# EAGLE schematic schematic (EAGLE 9.2.2)

## Sheet 1 of 3
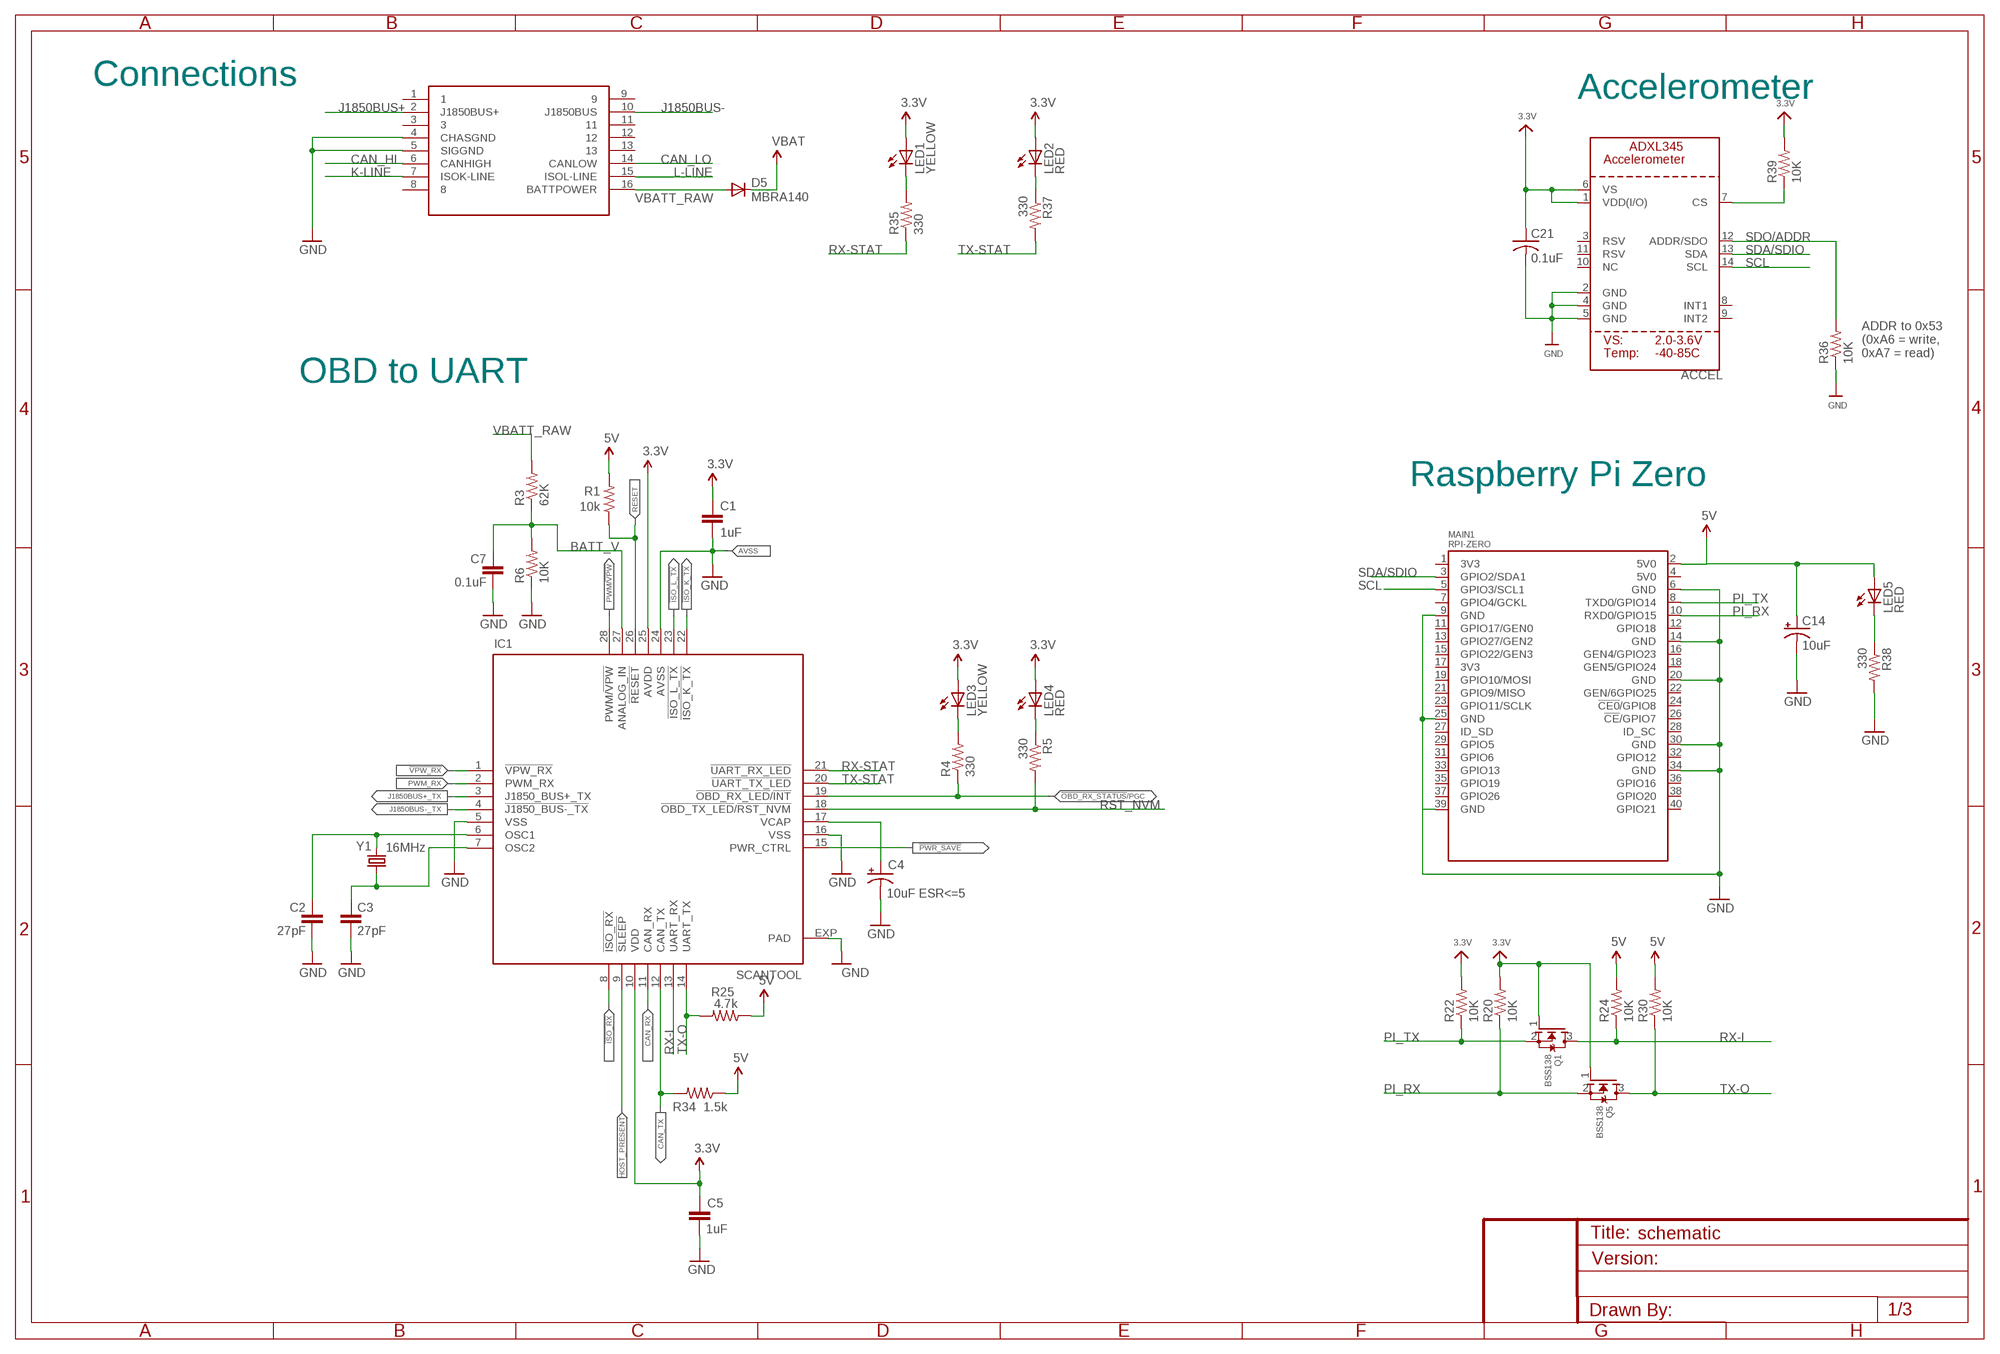
[diagram p0: schematic, sheet 1]

### Parts
ACCEL  ACCEL_ADXL345  [LGA14]
C1  1uF  CAP0402-CAP  [0402-CAP]
C2  27pF  CAP0402-CAP  [0402-CAP]
C3  27pF  CAP0402-CAP  [0402-CAP]
C4  10uF ESR<=5  CAP_POL1206  [EIA3216]
C5  1uF  CAP0402-CAP  [0402-CAP]
C7  0.1uF  CAP0402-CAP  [0402-CAP]
C14  10uF  CAP_POL1206  [EIA3216]
C21  0.1uF  C-USC0805  [C0805]
D5  MBRA140  DIODESMA  [SMA-DIODE]
IC1  SCANTOOL  [_STN_SCANTOOL_QFN-28-S]
LED1  YELLOW  LED0603  [LED-0603]
LED2  RED  LED0603  [LED-0603]
LED3  YELLOW  LED0603  [LED-0603]
LED4  RED  LED0603  [LED-0603]
LED5  RED  LED0603  [LED-0603]
MAIN1  RPI-ZERO  [RASPBERRYPI_BASTELSTUBE_V13_RASPI_BOARD_B+_FULL]
OBD_CONN  OBDII  [OBDII]
Q1  BSS138  MOSFET-NWIDE  [SOT23-WIDE]
Q5  BSS138  MOSFET-NWIDE  [SOT23-WIDE]
R1  10k  RESISTOR0402-RES  [0402-RES]
R3  62K  RESISTOR0402-RES  [0402-RES]
R4  330  RESISTOR0402-RES  [0402-RES]
R5  330  RESISTOR0402-RES  [0402-RES]
R6  10K  RESISTOR0402-RES  [0402-RES]
R20  10K  R-US_R0805  [R0805]
R22  10K  R-US_R0805  [R0805]
R24  10K  R-US_R0805  [R0805]
R25  4.7k  RESISTOR0402-RES  [0402-RES]
R30  10K  R-US_R0805  [R0805]
R34  1.5k  RESISTOR0402-RES  [0402-RES]
R35  330  RESISTOR0402-RES  [0402-RES]
R36  10K  R-US_R0805  [R0805]
R37  330  RESISTOR0402-RES  [0402-RES]
R38  330  RESISTOR0402-RES  [0402-RES]
R39  10K  R-US_R0805  [R0805]
Y1  16MHz  CRYSTAL5X3  [CRYSTAL-SMD-5X3]

### Nets
3.3V [pwr]: ACCEL.1(VDD(I/O)) ACCEL.6(VS) C1.1 C5.1 C21.1 IC1.10(VDD) IC1.25(AVDD) LED1.A LED2.A LED3.A LED4.A Q1.1(G) Q5.1(G) R20.2 R22.2 R39.2 ; also sheet 2,3
5V [pwr]: C14.A(+) LED5.A MAIN1.2(5V0) R1.2 R24.2 R25.1 R30.2 R34.1 ; also sheet 2,3
!ISO_K_TX: IC1.22(!ISO_K_TX) ; also sheet 2
!ISO_L_TX: IC1.23(!ISO_L_TX) ; also sheet 2
!ISO_RX: IC1.8(!ISO_RX) ; also sheet 2
!OBD_RX_STATUS!/PGC: IC1.19(!OBD_RX_LED!/!INT) R4.1
!PWR_SAVE: IC1.15(PWR_CTRL)
!VPW_RX: IC1.1(!VPW_RX) ; also sheet 2
BATT_V: C7.1 IC1.27(ANALOG_IN) R3.1 R6.2
CAN_HI: OBD_CONN.6(CANHIGH) ; also sheet 2
CAN_LO: OBD_CONN.14(CANLOW) ; also sheet 2
CAN_RX: IC1.11(CAN_RX) ; also sheet 2
CAN_TX: IC1.12(CAN_TX) R34.2 ; also sheet 2
GND [pwr]: ACCEL.2(GND) ACCEL.4(GND) ACCEL.5(GND) C1.2 C2.2 C3.2 C4.C(-) C5.2 C7.2 C14.C(-) C21.2 IC1.5(VSS) IC1.16(VSS) IC1.24(AVSS) IC1.EXP(PAD) MAIN1.6(GND) MAIN1.9(GND) MAIN1.14(GND) MAIN1.20(GND) MAIN1.25(GND) MAIN1.30(GND) MAIN1.34(GND) MAIN1.39(GND) OBD_CONN.4(CHASGND) OBD_CONN.5(SIGGND) R6.1 R36.1 R38.2 ; also sheet 2,3
HOST_PRESENT: IC1.9(!SLEEP)
J1850BUS+: OBD_CONN.2(J1850BUS+) ; also sheet 2
J1850BUS+_TX: IC1.3(J1850_BUS+_TX) ; also sheet 2
J1850BUS-: OBD_CONN.10(J1850BUS) ; also sheet 2
J1850BUS-_TX: IC1.4(!J1850_BUS-_TX) ; also sheet 2
K-LINE: OBD_CONN.7(ISOK-LINE) ; also sheet 2
L-LINE: OBD_CONN.15(ISOL-LINE) ; also sheet 2
N$2: ACCEL.7(CS) R39.1
N$15: LED5.C R38.1
N$26: C4.A(+) IC1.17(VCAP)
N$30: LED3.C R4.2
N$31: LED4.C R5.1
N$35: LED1.C R35.2
N$36: LED2.C R37.1
OSC1: C2.1 IC1.6(OSC1) Y1.3
OSC2: C3.1 IC1.7(OSC2) Y1.1
PI_RX: MAIN1.10(RXD0/GPIO15) Q5.2(S) R20.1
PI_TX: MAIN1.8(TXD0/GPIO14) Q1.2(S) R22.1
PWM/!VPW: IC1.28(PWM/!VPW) ; also sheet 3
PWM_RX: IC1.2(PWM_RX) ; also sheet 2
RESET: IC1.26(!RESET) R1.1
RST_NVM: IC1.18(!OBD_TX_LED!/!RST_NVM) R5.2
RX-I: IC1.13(UART_RX) Q1.3(D) R24.1
RX-STAT: IC1.21(!UART_RX_LED) R35.1
SCL: ACCEL.14(SCL) MAIN1.5(GPIO3/SCL1)
SDA/SDIO: ACCEL.13(SDA) MAIN1.3(GPIO2/SDA1)
SDO/ADDR: ACCEL.12(ADDR/SDO) R36.2
TX-O: IC1.14(UART_TX) Q5.3(D) R25.2 R30.1
TX-STAT: IC1.20(!UART_TX_LED) R37.2
VBATT_RAW: D5.A OBD_CONN.16(BATTPOWER) R3.2
VCC [pwr]: D5.C ; supply symbol labelled VBAT ; also sheet 2
Unconnected: ACCEL.3(RSV) ACCEL.8(INT1) ACCEL.9(INT2) ACCEL.10(NC) ACCEL.11(RSV) MAIN1.1(3V3) MAIN1.4(5V0) MAIN1.7(GPIO4/GCKL) MAIN1.11(GPIO17/GEN0) MAIN1.12(GPIO18) MAIN1.13(GPIO27/GEN2) MAIN1.15(GPIO22/GEN3) MAIN1.16(GEN4/GPIO23) MAIN1.17(3V3) MAIN1.18(GEN5/GPIO24) MAIN1.19(GPIO10/MOSI) MAIN1.21(GPIO9/MISO) MAIN1.22(GEN/6GPIO25) MAIN1.23(GPIO11/SCLK) MAIN1.24(!CE0!/GPIO8) MAIN1.26(!CE!/GPIO7) MAIN1.27(ID_SD) MAIN1.28(ID_SC) MAIN1.29(GPIO5) MAIN1.31(GPIO6) MAIN1.32(GPIO12) MAIN1.33(GPIO13) MAIN1.35(GPIO19) MAIN1.36(GPIO16) MAIN1.37(GPIO26) MAIN1.38(GPIO20) MAIN1.40(GPIO21) OBD_CONN.1 OBD_CONN.3 OBD_CONN.8 OBD_CONN.9 OBD_CONN.11 OBD_CONN.12 OBD_CONN.13

### Notes on the sheet
- Connections
- Accelerometer
- ADDR to 0x53 
  (0xA6 = write, 
  0xA7 = read)
- OBD to UART
- Raspberry Pi Zero
- AVSS

## Sheet 2 of 3
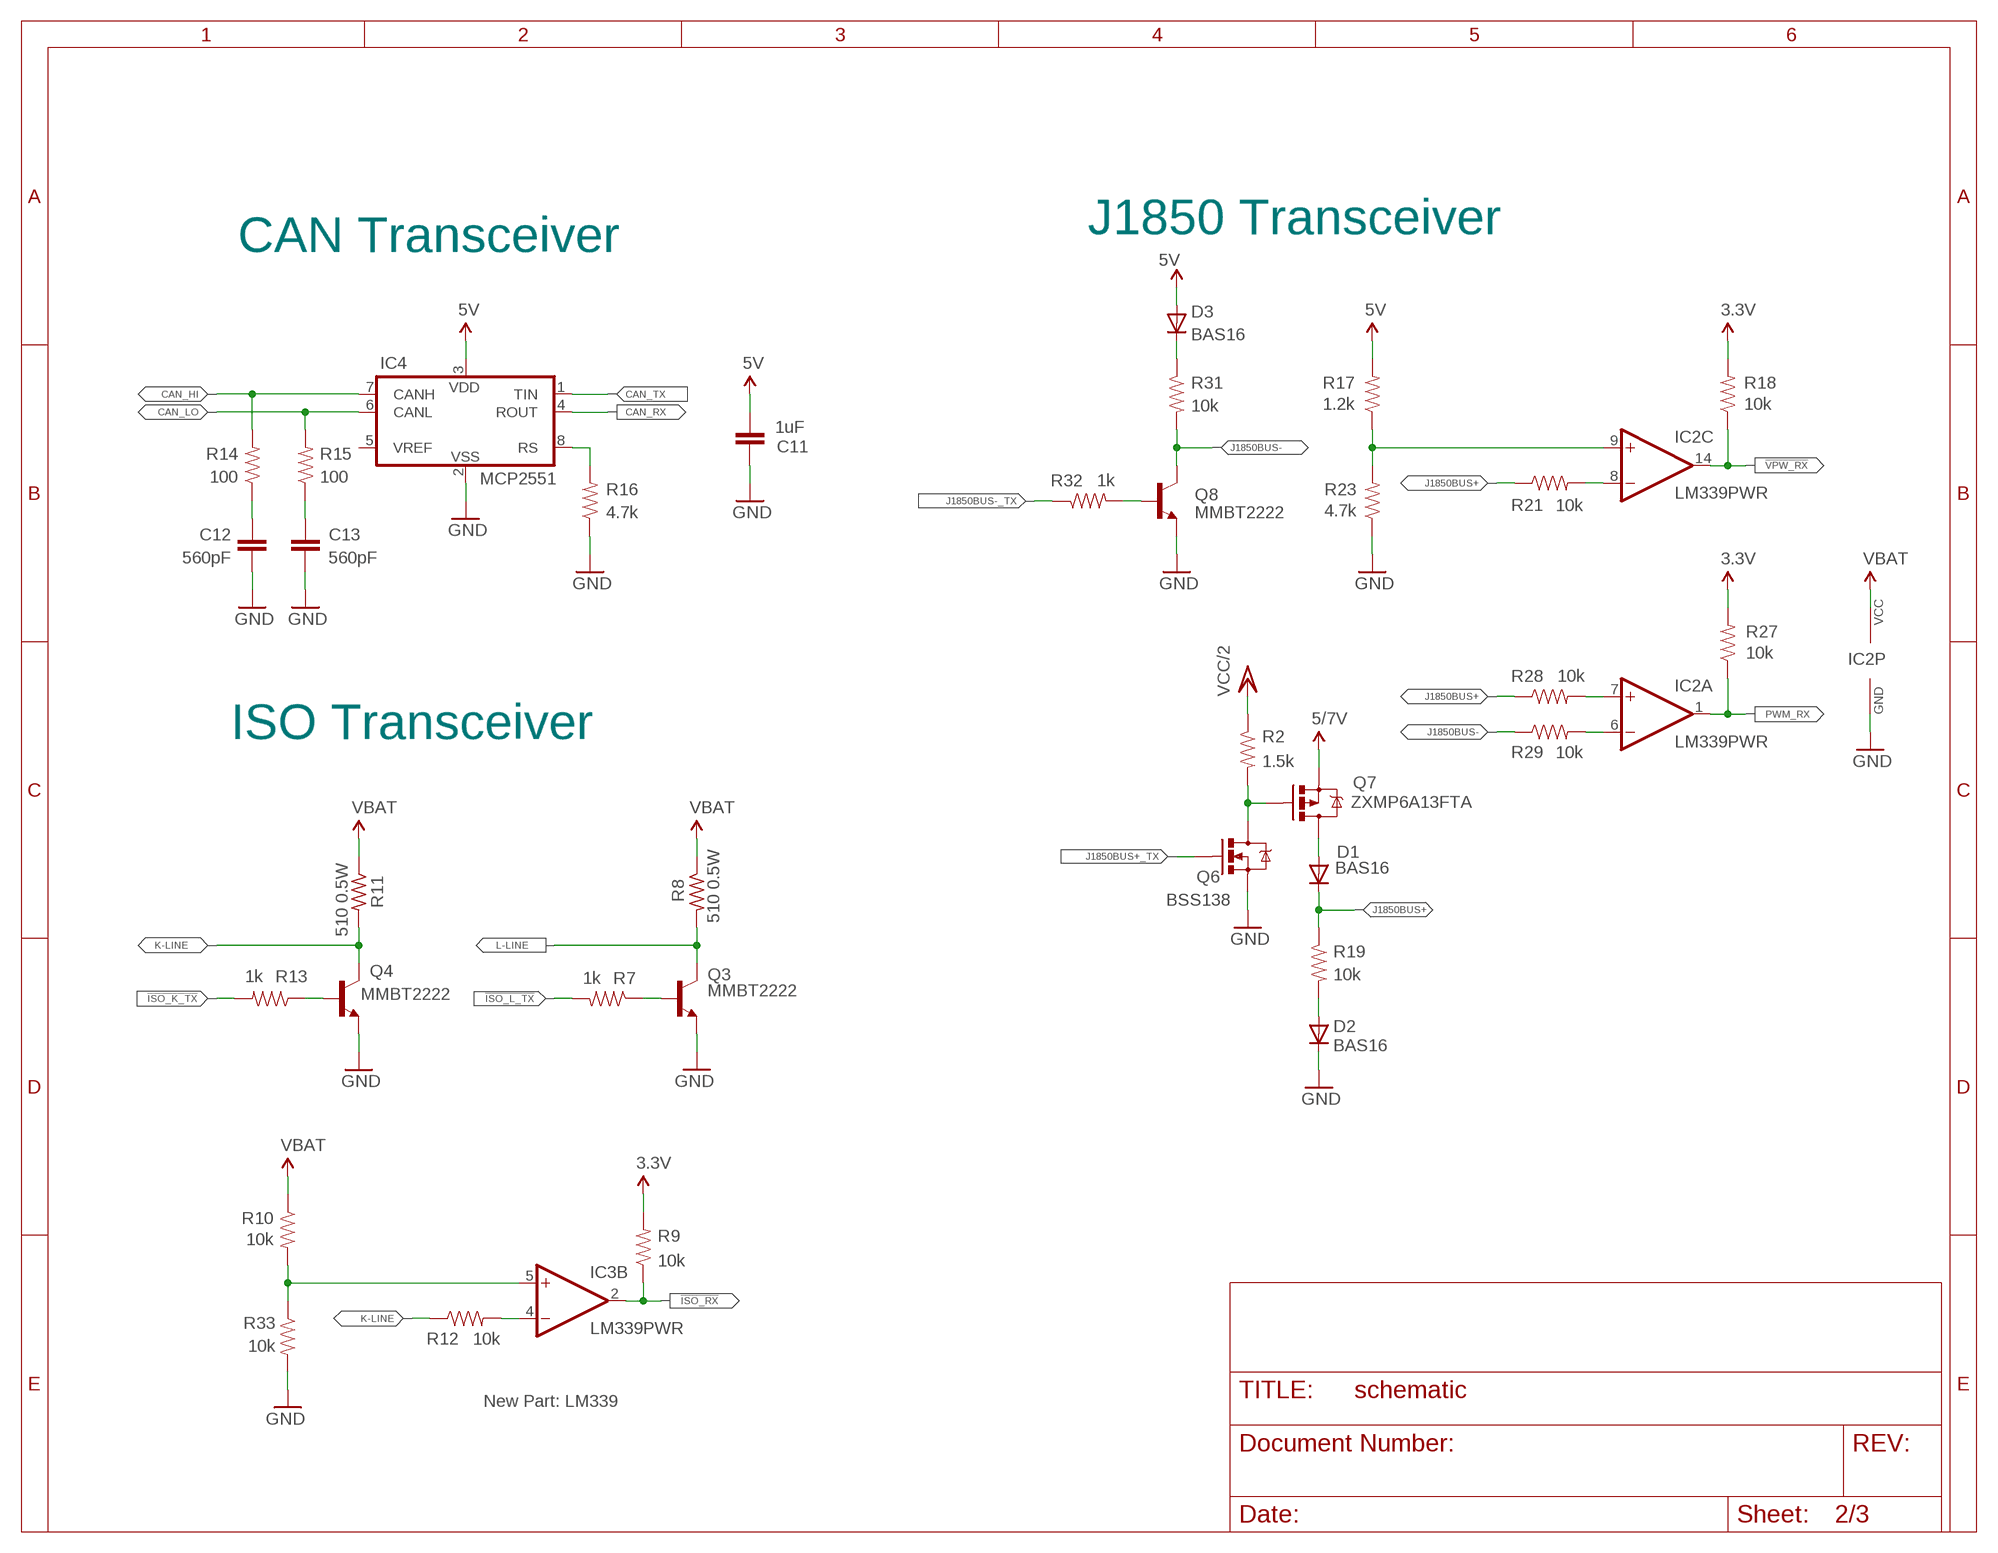
[diagram p1: schematic, sheet 2]

### Parts
C11  1uF  CAP0402-CAP  [0402-CAP]
C12  560pF  CAP0402-CAP  [0402-CAP]
C13  560pF  CAP0402-CAP  [0402-CAP]
D1  BAS16  DIODESOD  [SOD-323]
D2  BAS16  DIODESOD  [SOD-323]
D3  BAS16  DIODESOD  [SOD-323]
IC2  LM339PWR  [TSSOP-14]
IC3  LM339PWR  [TSSOP-14]
IC4  MCP2551  MCP2551-I/SN  [SO-8]
Q3  MMBT2222  TRANSISTOR_NPNSOT23-3  [SOT23-3]
Q4  MMBT2222  TRANSISTOR_NPNSOT23-3  [SOT23-3]
Q6  BSS138  MOSFET-NCHANNELSMD  [SOT23-3]
Q7  ZXMP6A13FTA  MOSFET-PCHANNEL  [SOT23]
Q8  MMBT2222  TRANSISTOR_NPNSOT23-3  [SOT23-3]
R2  1.5k  RESISTOR0402-RES  [0402-RES]
R7  1k  RESISTOR0402-RES  [0402-RES]
R8  510 0.5W  R-US_2010  [2010]
R9  10k  RESISTOR0402-RES  [0402-RES]
R10  10k  RESISTOR0402-RES  [0402-RES]
R11  510 0.5W  R-US_2010  [2010]
R12  10k  RESISTOR0402-RES  [0402-RES]
R13  1k  RESISTOR0402-RES  [0402-RES]
R14  100  RESISTOR0402-RES  [0402-RES]
R15  100  RESISTOR0402-RES  [0402-RES]
R16  4.7k  RESISTOR0402-RES  [0402-RES]
R17  1.2k  RESISTOR0402-RES  [0402-RES]
R18  10k  RESISTOR0402-RES  [0402-RES]
R19  10k  RESISTOR0402-RES  [0402-RES]
R21  10k  RESISTOR0402-RES  [0402-RES]
R23  4.7k  RESISTOR0402-RES  [0402-RES]
R27  10k  RESISTOR0402-RES  [0402-RES]
R28  10k  RESISTOR0402-RES  [0402-RES]
R29  10k  RESISTOR0402-RES  [0402-RES]
R31  10k  RESISTOR0402-RES  [0402-RES]
R32  1k  RESISTOR0402-RES  [0402-RES]
R33  10k  RESISTOR0402-RES  [0402-RES]

### Nets
3.3V [pwr]: R9.2 R18.2 R27.2 ; also sheet 1,3
5V [pwr]: C11.1 D3.2(A) IC4.3(VDD) R17.2 ; also sheet 1,3
!ISO_K_TX: R13.2 ; also sheet 1
!ISO_L_TX: R7.2 ; also sheet 1
!ISO_RX: IC3.2(B:OUT) R9.1 ; also sheet 1
!VPW_RX: IC2.14(C:OUT) R18.1 ; also sheet 1
CAN_HI: IC4.7(CANH) R14.2 ; also sheet 1
CAN_LO: IC4.6(CANL) R15.2 ; also sheet 1
CAN_RX: IC4.4(ROUT) ; also sheet 1
CAN_TX: IC4.1(TIN) ; also sheet 1
GND [pwr]: C11.2 C12.2 C13.2 D2.1(C) IC2.12(P:GND) IC4.2(VSS) Q3.2(E) Q4.2(E) Q6.2(S) Q8.2(E) R16.1 R23.1 R33.2 ; also sheet 1,3
J1850BUS+: D1.1(C) R19.1 R21.1 R28.1 ; also sheet 1
J1850BUS+_TX: Q6.1(G) ; also sheet 1
J1850BUS-: Q8.3(C) R29.1 R31.2 ; also sheet 1
J1850BUS-_TX: R32.1 ; also sheet 1
K-LINE: Q4.3(C) R11.2 R12.1 ; also sheet 1
L-LINE: Q3.3(C) R8.2 ; also sheet 1
N$1: IC2.7(A:+IN) R28.2
N$3: IC2.6(A:-IN) R29.2
N$4: Q4.1(B) R13.1
N$5: Q3.1(B) R7.1
N$6: IC3.5(B:+IN) R10.2 R33.1
N$7: IC2.8(C:-IN) R21.2
N$8: Q6.3(D) Q7.1(G) R2.2
N$9: D2.2(A) R19.2
N$10: C12.1 R14.1
N$11: IC4.8(RS) R16.2
N$12: IC2.9(C:+IN) R17.1 R23.2
N$13: IC3.4(B:-IN) R12.2
N$14: D3.1(C) R31.1
N$16: D1.2(A) Q7.3(D)
N$25: Q8.1(B) R32.2
N$27: C13.1 R15.1
PWM_RX: IC2.1(A:OUT) R27.1 ; also sheet 1
VBAT [pwr]: IC2.3(P:VCC) R8.1 R10.1 R11.1 ; also sheet 3
VCC [pwr]: Q7.2(S) ; supply symbol labelled 5/7V ; also sheet 1
VCC/2 [pwr]: R2.1 ; also sheet 3
Unconnected: IC2.2(B:OUT) IC2.4(B:-IN) IC2.5(B:+IN) IC2.10(D:-IN) IC2.11(D:+IN) IC2.13(D:OUT) IC3.1(A:OUT) IC3.6(A:-IN) IC3.7(A:+IN) IC3.8(C:-IN) IC3.9(C:+IN) IC3.10(D:-IN) IC3.11(D:+IN) IC3.13(D:OUT) IC3.14(C:OUT) IC4.5(VREF)

### Notes on the sheet
- J1850 Transceiver
- CAN Transceiver
- ISO Transceiver
- New Part: LM339

## Sheet 3 of 3
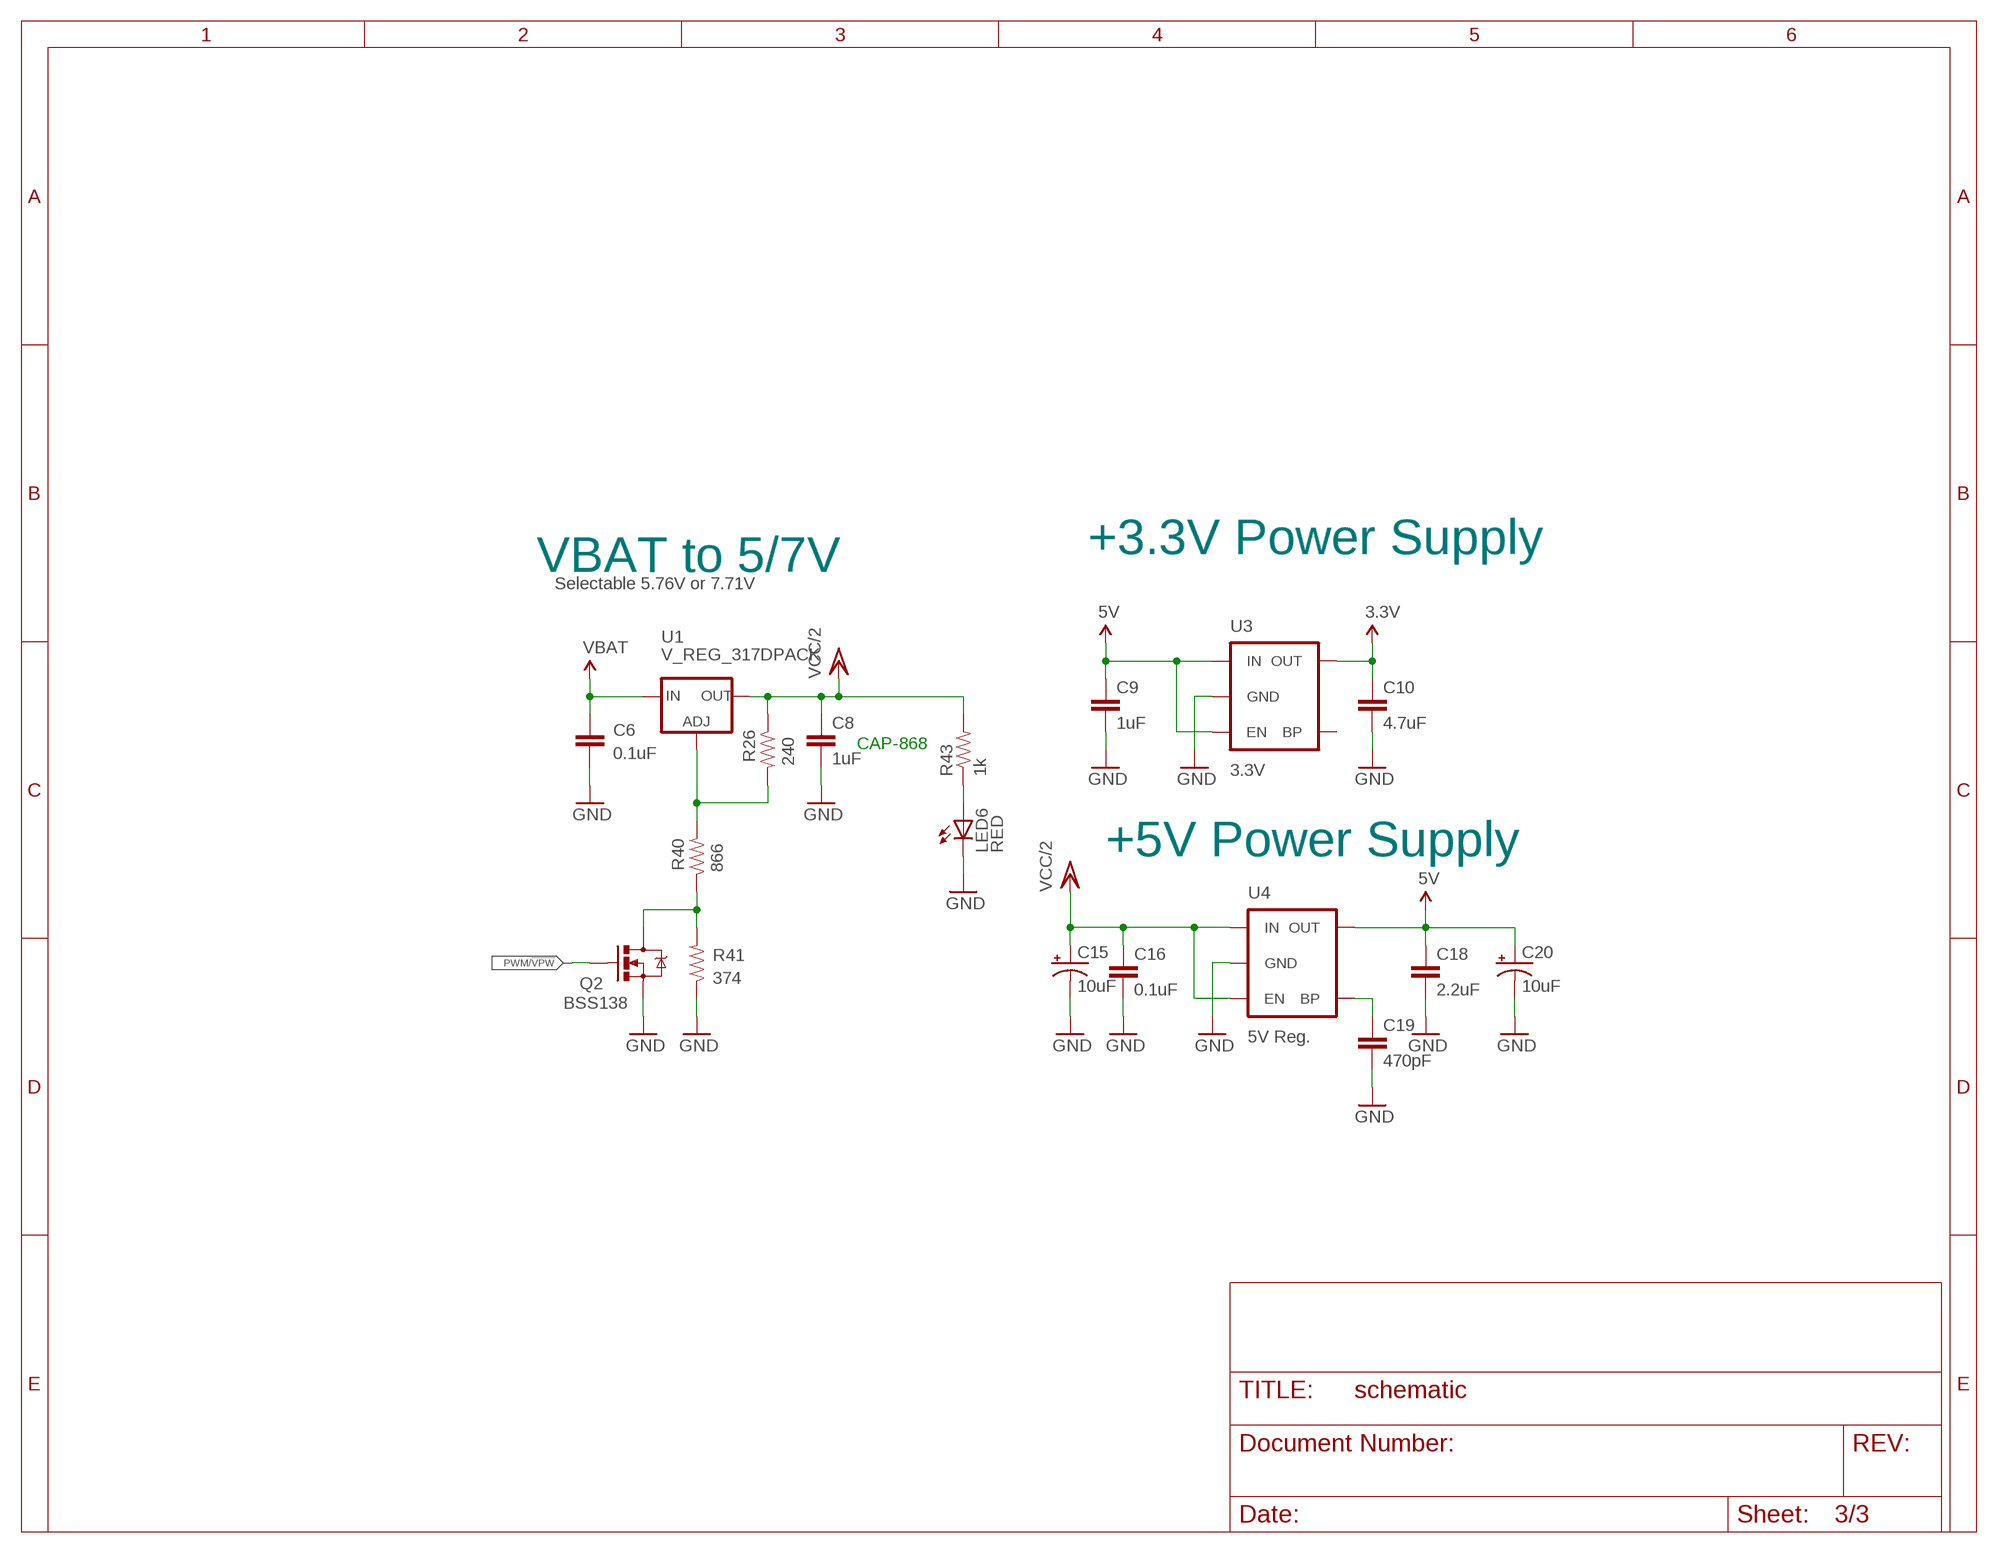
[diagram p2: schematic, sheet 3]

### Parts
C6  0.1uF  CAP0402-CAP  [0402-CAP]
C8  1uF  CAP0402-CAP  [0402-CAP]
C9  1uF  CAP0402-CAP  [0402-CAP]
C10  4.7uF  CAP0402-CAP  [0402-CAP]
C15  10uF  CAP_POL1206  [EIA3216]
C16  0.1uF  CAP0402-CAP  [0402-CAP]
C18  2.2uF  CAP0402-CAP  [0402-CAP]
C19  470pF  CAP0402-CAP  [0402-CAP]
C20  10uF  CAP_POL1206  [EIA3216]
LED6  RED  LED0603  [LED-0603]
Q2  BSS138  MOSFET-NCHANNELSMD  [SOT23-3]
R26  240  RESISTOR0402-RES  [0402-RES]
R40  866  RESISTOR0402-RES  [0402-RES]
R41  374  RESISTOR0402-RES  [0402-RES]
R43  1k  RESISTOR0402-RES  [0402-RES]
U1  V_REG_317DPACK  [V-REG_DPACK]
U3  3.3V  V_REG_LDOSMD  [SOT23-5]
U4  5V Reg.  V_REG_LDOSMD  [SOT23-5]

### Nets
3.3V [pwr]: C10.1 U3.5(OUT) ; also sheet 1,2
5V [pwr]: C9.1 C18.1 C20.A(+) U3.1(IN) U3.3(EN) U4.5(OUT) ; also sheet 1,2
GND [pwr]: C6.2 C8.2 C9.2 C10.2 C15.C(-) C16.2 C18.2 C19.2 C20.C(-) LED6.C Q2.2(S) R41.1 U3.2(GND) U4.2(GND) ; also sheet 1,2
N$17: Q2.3(D) R40.1 R41.2
N$20: R26.2 R40.2 U1.1(ADJ)
N$23: LED6.A R43.1
N$28: C19.1 U4.4(BP)
PWM/!VPW: Q2.1(G) ; also sheet 1
VBAT [pwr]: C6.1 U1.3(IN) ; also sheet 2
VCC/2 [pwr]: C8.1 C15.A(+) C16.1 R26.1 R43.2 U1.4(OUT) U4.1(IN) U4.3(EN) ; also sheet 2
Unconnected: U3.4(BP)

### Notes on the sheet
- +3.3V Power Supply
- VBAT to 5/7V
- Selectable 5.76V or 7.71V
- CAP-868
- +5V Power Supply

## Power pins joined to a net without a drawn wire
GND: IC3.12(P:GND)
VCC: IC3.3(P:VCC)

## Library data of the parts
ACCEL = microbuilder:ACCEL_ADXL345: ADXL345 - Digital 3-Axis Accelerometer (I2C/SPI)
C1-C3 C5-C13 C16 C18 C19 = SparkFun:CAP: Capacitor Standard 0603 ceramic capacitor, and 0.1" leaded capacitor.
C4 C14 C15 C20 = SparkFun:CAP_POL: Capacitor Polarized These are standard SMD and PTH capacitors. Normally 10uF, 47uF, and 100uF in electrolytic and tantalum varieties. Always verify the external diameter of the through hole cap, it varies with capacity, voltage, and manufacturer. The EIA devices should be standard.
C21 = adafruit:C-US: CAPACITOR, American symbol
D1-D3 D5 = SparkFun:DIODE: Diode These are standard reverse protection diodes and small signal diodes. SMA package can handle up to about 1A. SOD-323 can handle about 200mA. What the SOD-323 package when ordering, there are some mfgs out there that are 5-pin packages.
IC1 = SparkFun:SCANTOOL: STN1110 - Multiprotocol OBD II to UART Interpreter, QFN Package Change Log Date Author Change Aug 23, 2010 vit@scantool.net Created device
IC2 IC3 = _stn_logic:LM339PWR: Quad Differential Comparators Based on information from the SLCS006N datasheet from TI (www.ti.com). Change Log Date Author Change July 16, 2008 nick@scantool.net Device created.; DESC: IC, Quad Comparator; MANUF: Texas Instruments; PARTNUM: LM339PWR; SUPPLIER: Digikey:296-6607-1-ND; VALSTAT: PARTNUM
IC4 = _stn_microchip:MCP2551: CAN Driver Based on information from the MPC2551 datasheet from Microchip. http://www.microchip.com/ Change Log Date Author Change November 12, 2008 joe@scantool.net Renamed "TXD" to "TIN" and "RXD" to "ROUT" Fixed mislabeled pins "CANH" and CANL"; DESC: IC, CAN Transceiver; MANUF: Microchip Technology; PARTNUM: MCP2551-I/SN; SUPPLIER: Digikey:MCP2551-I/SN-ND; VALSTAT: PARTNUM
LED1-LED6 = SparkFun:LED: LEDs Standard schematic elements and footprints for 5mm, 3mm, 1206, and 0603 sized LEDs. 5mm - Spark Fun Electronics SKU : COM-00529 (and others)
MAIN1 = RPI-Zero:RPI-ZERO
OBD_CONN = SparkFun-Connectors:OBDII: OBD-II Connector OBDII is an on board diagnostics standard that is used on a large variety of cars. Here is the connector we sell at SparkFun: OBD-II connector <https://www.sparkfun.com/products/9911> (DEV-09911) Info and Pinout <http://pinoutsguide.com/CarElectronics/car_obd2_pinout.shtml> (sorry, no datasheet) We do not use this connector on any active designs, however, if you're looking for OBDII tech, please check out these: SparkFun OBD related products <https://www.sparkfun.com/search/results?term=obd>; SF_ID: DEV-09911
Q1 Q5 = microbuilder:MOSFET-N: N-Channel Mosfet LEGEND VDS: Voltage Drain-Source ID: Drain Current RDS(ON): Drain-Source On-State Resistance VGS(TH): Gate-Source Threshold Voltage CISS: Drain-Source Input Capacitance SOT-23 Name VDS ID RDS(ON) VGS(TH) CISS Order Number 2N7002E 60V 260mA 2.5 Ohm 2.5V @ 250uA 26.7pF @ 25V 2N7002ET1GOSTR-ND BSH103 30V 850mA 400 mOhm 400mV @ 1mA 83pF @ 24V BSH103,235-ND BSS138 60V 320mA 1.6 Ohm 1.5V @ 250uA 50pF @ 10V Mouser: 771-BSS138PW115 DMN2075U-7 20V 4.2A 38 mOhm 1V @ 250 uA 594.3pF @ 10V DMN2075U-7DICT-ND * BSS138 good choice for I2C level-shifting
Q2 Q6 = SparkFun:MOSFET-NCHANNEL
Q3 Q4 Q8 = SparkFun:TRANSISTOR_NPN: Transistor NPN BJT configuration in SOT23 package. MMBT2222 is the common NPN we use. Double check BCE configuration again layout.
Q7 = SparkFun:MOSFET-PCHANNEL
R1-R7 R9 R10 R12-R19 R21 R23 R25-R29 R31-R35 R37 R38 R40 R41 R43 = SparkFun:RESISTOR: Resistor Basic schematic elements and footprints for 0603, 1206, and PTH resistors.
R8 R11 = _stn_rcl:R-US: Resistor, US Symbol Change Log Date Author Change November 13, 2006 vit@scantool.net Moved underscore from the end of device name to beginning of variant names. May 27, 2006 vitaliy@scantool.net Added description.; DESC: Resistor; VALSTAT: VAL
R20 R22 R24 R30 R36 R39 = adafruit:R-US_: RESISTOR, American symbol
U1 = SparkFun:V_REG_317: Voltage Regulator Standard LM317 adjustable voltage regulator. AOI (Adjust Output Input). Google 'LM317 Calculator' for easy to use app to get the two resistor values needed. 240/720 for 5V output. 240/390 for 3.3V output. Spark Fun Electronics SKU : COM-00527
U3 U4 = SparkFun:V_REG_LDO: Voltage Regulator LDO Standard 150mA LDO voltage regulator in SOT-23 layout. Micrel part MIC5205. BP (by-pass) pin is used to lower output noise with 470pF cap.
Y1 = SparkFun:CRYSTAL: Crystals Various standard crystals. Proven footprints. Spark Fun Electronics SKU : COM-00534

## Net classes
0 default: width 0.178 mm, drill 0.508 mm, clearance 0.305 mm
1 pwr: width 0.305 mm, drill 0.508 mm, clearance 0.305 mm